# Altium schematic sheet project1 Lyalina Veronika.SchDoc
size A3; SheetNumber: 1; SheetTotal: 1
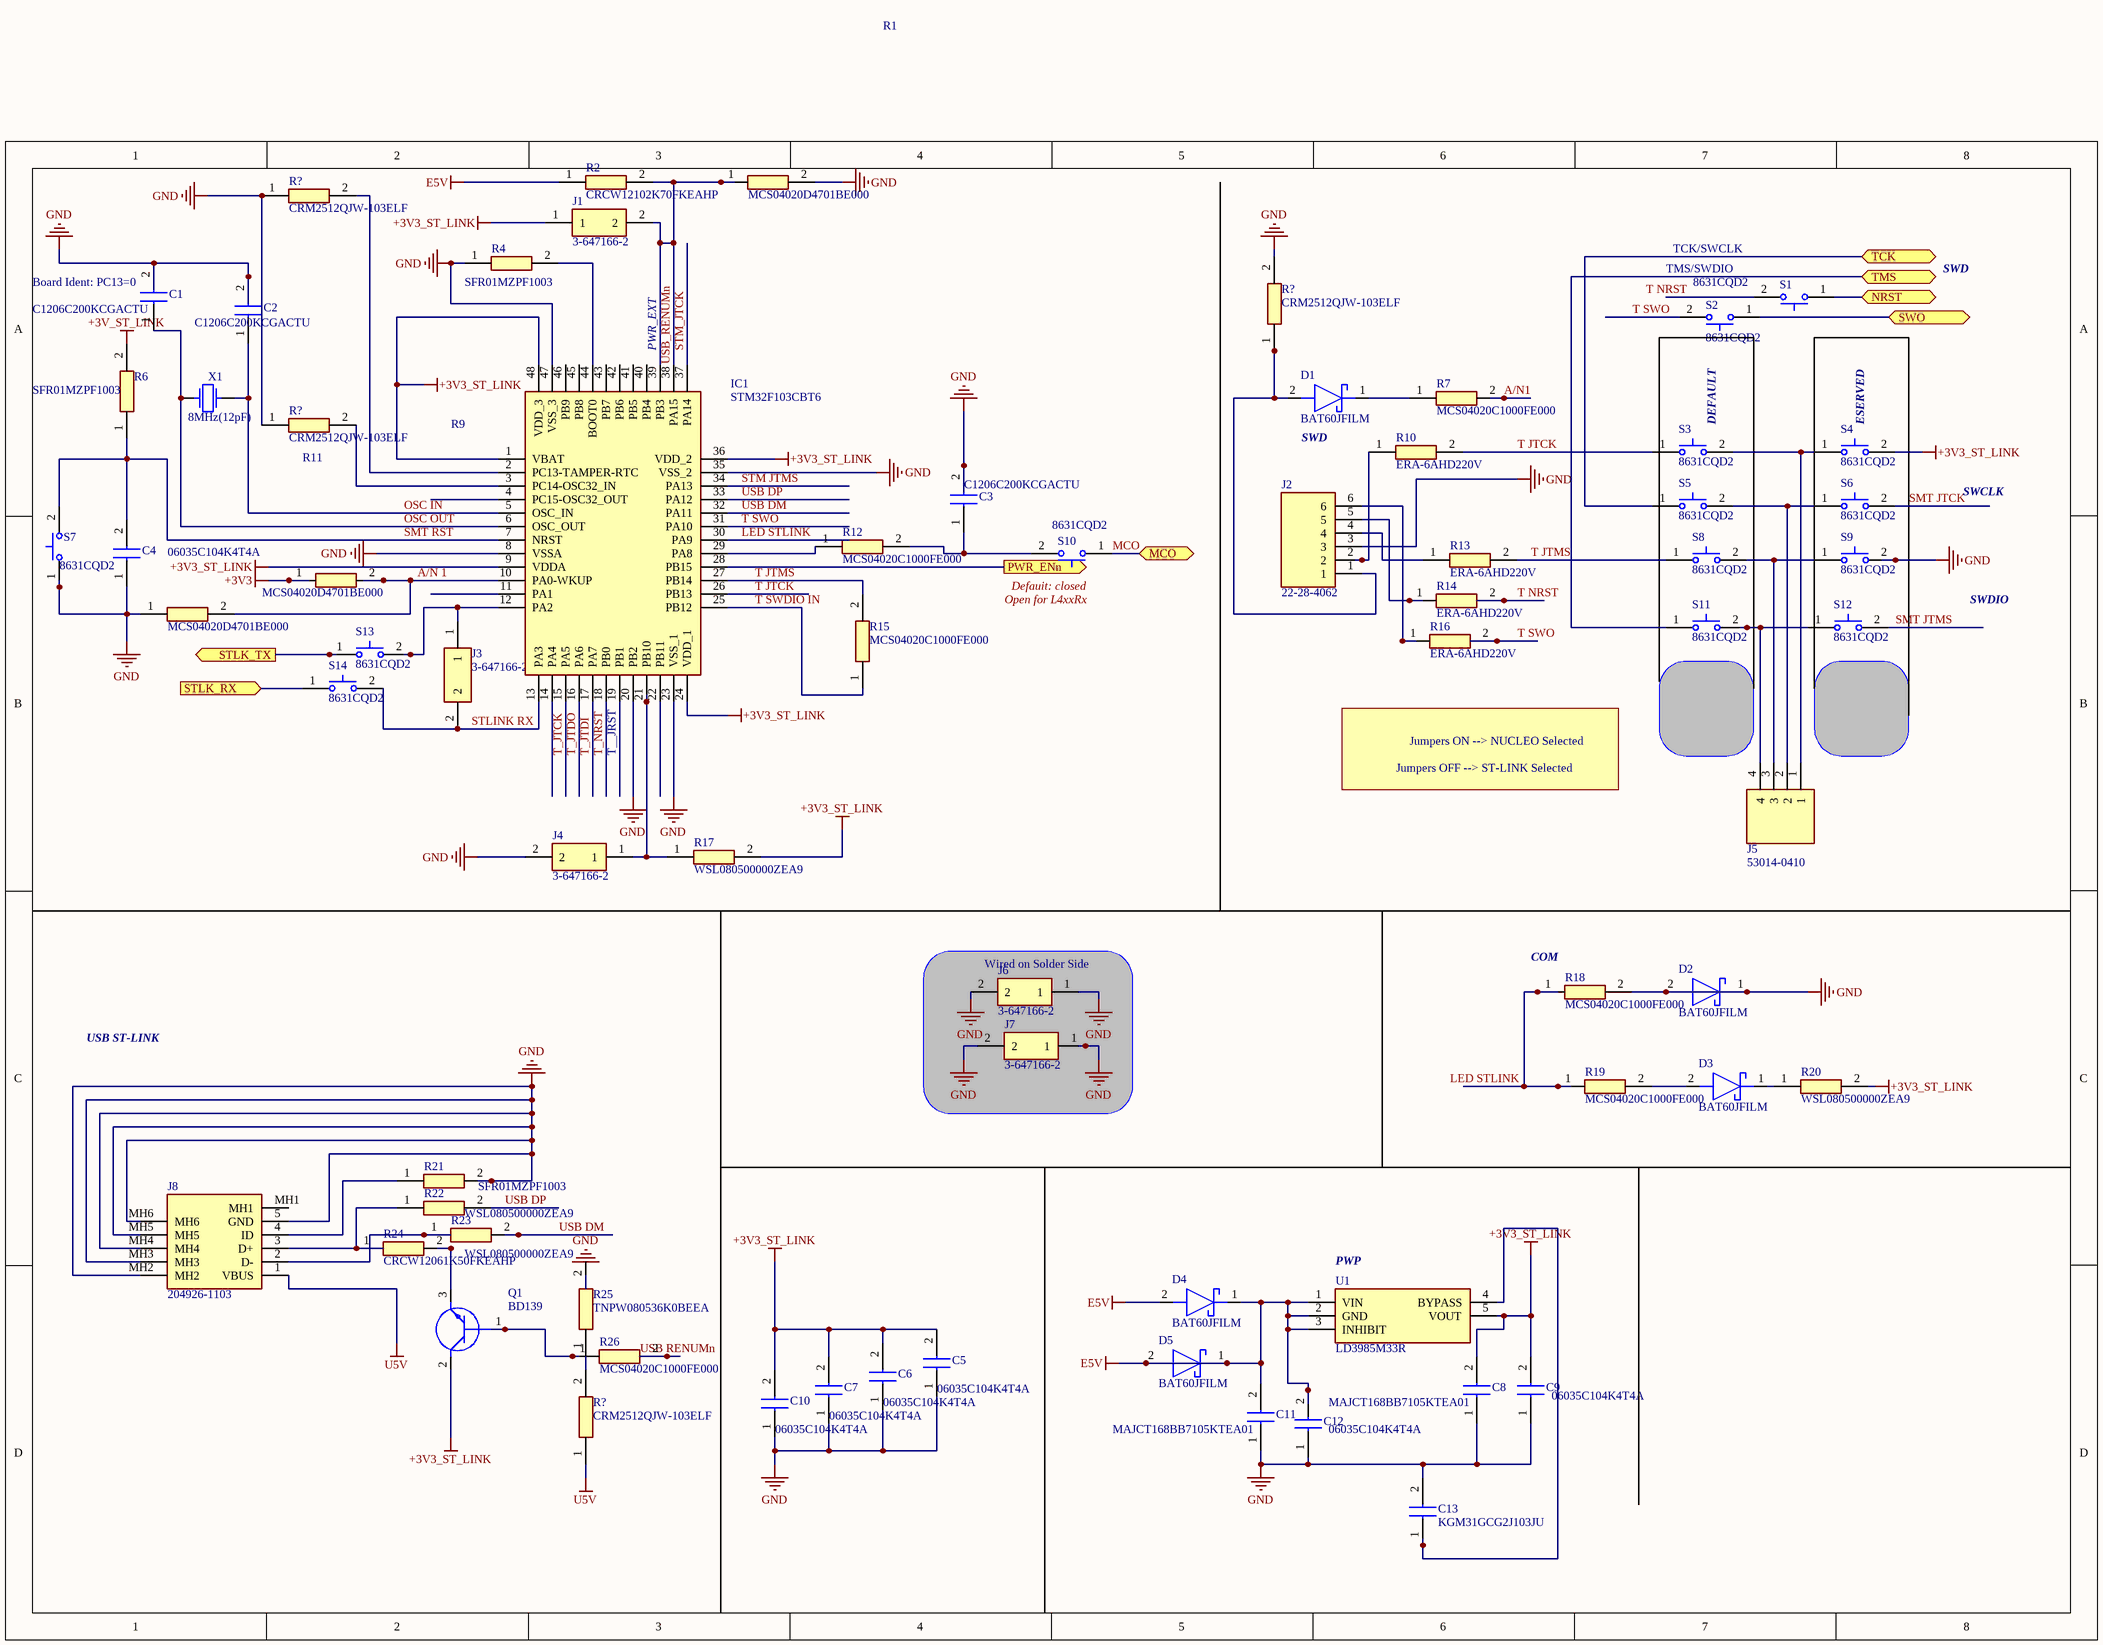
[diagram p0: project1 Lyalina Veronika.SchDoc]

## Parts
(Parts that share a designator on the sheet are numbered #1, #2 ... from top to bottom, then left to right.)
C1  C1206C200KCGACTU  [C1206]
C2  C1206C200KCGACTU  [C1206]
C3  C1206C200KCGACTU  [C1206]
C4  06035C104K4T4A  [CAPC1608X90N]
C5  06035C104K4T4A  [CAPC1608X90N]
C6  06035C104K4T4A  [CAPC1608X90N]
C7  06035C104K4T4A  [CAPC1608X90N]
C8  MAJCT168BB7105KTEA01  [MAJx16]
C9  06035C104K4T4A  [CAPC1608X90N]
C10  06035C104K4T4A  [CAPC1608X90N]
C11  MAJCT168BB7105KTEA01  [MAJx16]
C12  06035C104K4T4A  [CAPC1608X90N]
C13  KGM31GCG2J103JU  [CAPC3316X145N]
D1  BAT60JFILM  [SOD2513X117N]
D2  BAT60JFILM  [SOD2513X117N]
D3  BAT60JFILM  [SOD2513X117N]
D4  BAT60JFILM  [SOD2513X117N]
D5  BAT60JFILM  [SOD2513X117N]
IC1  STM32F103CBT6  [QFP50P900X900X160-48N]
J1  3-647166-2  [36471662]
J2  22-28-4062  [HDRV6W66P0X254_1X6_1524X249X838P]
J3  3-647166-2  [36471662]
J4  3-647166-2  [36471662]
J5  53014-0410  [SHDR4W60P0X200_1X4_1200X435X1000P]
J6  3-647166-2  [36471662]
J7  3-647166-2  [36471662]
J8  204926-1103  [2049261103]
Q1  BD139  [TO254P290X760X1320-3P]
R1  MCS04020D4701BE000  [RESC1005X37N]
R2  CRCW12102K70FKEAHP  [RESC3225X70N]
R4  SFR01MZPF1003  [RESC1005X40N]
R6  SFR01MZPF1003  [RESC1005X40N]
R7  MCS04020C1000FE000  [RESC1005X37N]
R9  MCS04020D4701BE000  [RESC1005X37N]
R10  ERA-6AHD220V  [ERA6AEB1020V]
R11  MCS04020D4701BE000  [RESC1005X37N]
R12  MCS04020C1000FE000  [RESC1005X37N]
R13  ERA-6AHD220V  [ERA6AEB1020V]
R14  ERA-6AHD220V  [ERA6AEB1020V]
R15  MCS04020C1000FE000  [RESC1005X37N]
R16  ERA-6AHD220V  [ERA6AEB1020V]
R17  WSL080500000ZEA9  [RESC2013X84N]
R18  MCS04020C1000FE000  [RESC1005X37N]
R19  MCS04020C1000FE000  [RESC1005X37N]
R20  WSL080500000ZEA9  [RESC2013X84N]
R21  SFR01MZPF1003  [RESC1005X40N]
R22  WSL080500000ZEA9  [RESC2013X84N]
R23  WSL080500000ZEA9  [RESC2013X84N]
R24  CRCW12061K50FKEAHP  [RESC3116X65N]
R25  TNPW080536K0BEEA  [RESC2012X55N]
R26  MCS04020C1000FE000  [RESC1005X37N]
R?#1  CRM2512QJW-103ELF  [RESC6331X80N]
R?#2  CRM2512QJW-103ELF  [RESC6331X80N]
R?#3  CRM2512QJW-103ELF  [RESC6331X80N]
R?#4  CRM2512QJW-103ELF  [RESC6331X80N]
S1  8631CQD2  [8631CQD2]
S2  8631CQD2  [8631CQD2]
S3  8631CQD2  [8631CQD2]
S4  8631CQD2  [8631CQD2]
S5  8631CQD2  [8631CQD2]
S6  8631CQD2  [8631CQD2]
S7  8631CQD2  [8631CQD2]
S8  8631CQD2  [8631CQD2]
S9  8631CQD2  [8631CQD2]
S10  8631CQD2  [8631CQD2]
S11  8631CQD2  [8631CQD2]
S12  8631CQD2  [8631CQD2]
S13  8631CQD2  [8631CQD2]
S14  8631CQD2  [8631CQD2]
U1  LD3985M33R  [SOT95P280X145-5N]
X1  F0: 8MHz(12pF)  (hidden comment: Crystal)

## Blocks framed on the sheet
Wired on Solder Side: J6 J7

## Ports
MCO (bidir), NRST (bidir), PWR_ENn (out), STLK_RX (in), STLK_TX (out), SWO (bidir), TCK (bidir), TMS (bidir)

## Nets
+3V3: R9.1
+3V3_ST_LINK: C5.2 C6.2 C7.2 C8.2 C9.2 C10.2 IC1.1(VBAT) IC1.9(VDDA) IC1.24(VDD_1) IC1.36(VDD_2) IC1.48(VDD_3) J1.1 Q1.2(C) R17.2 R20.2 S4.2(N.O._2) U1.5(VOUT)
+3V_ST_LINK: R6.2
E5V: C11.2 C12.2 D4.1(K) D4.2(A) D5.1(K) D5.2(A) R2.1 U1.1(VIN) U1.2(GND) U1.3(INHIBIT)
GND: C1.2 C2.2 C3.2 C4.1 C5.1 C6.1 C7.1 C8.1 C9.1 C10.1 C11.1 C12.1 C13.2 D2.1(K) D2.2(A) IC1.8(VSSA) IC1.20(PB2) IC1.23(VSS_1) IC1.35(VSS_2) IC1.47(VSS_3) J2.3 J4.2 J6.1 J6.2 J7.1 J7.2 J8.5(GND) J8.MH2 J8.MH3 J8.MH4 J8.MH5 J8.MH6 R1.2 R4.1 R11.1 R18.2 R21.2 R?#1.1 R?#2.2 R?#3.1 S7.1(N.O._1) S9.2(N.O._2)
U5V: J8.1(VBUS) R?#4.1
MCO: S10.1(N.O._1) ; port MCO
NRST: S1.1(N.O._1) ; port NRST
PWR_ENn: IC1.28(PB15) ; port PWR_ENn
STLK_RX: S14.1(N.O._1) ; port STLK_RX
STLK_TX: S13.1(N.O._1) ; port STLK_TX
SWO: S2.1(N.O._1) ; port SWO
TCK: S5.1(N.O._1) ; port TCK
TMS: S11.1(N.O._1) ; port TMS
USB DM: R23.2
USB DP: R22.2
USB RENUMn: R26.2
NetC1_1: C1.1 IC1.6(OSC_OUT) X1.1
NetC2_1: C2.1 IC1.5(OSC_IN) X1.2
NetC3_1: C3.1 R12.2 S10.2(N.O._2)
NetC4_2: C4.2 IC1.7(NRST) R6.1 S7.2(N.O._2)
NetC13_1: C13.1 U1.4(BYPASS)
NetD1_1: D1.1(K) R7.1
NetD1_2: D1.2(A) J2.1 R?#2.1
NetD3_1: D3.1(K) R20.1
NetD3_2: D3.2(A) R19.2
NetIC1_2: IC1.2(PC13-TAMPER-RTC) R?#1.2
NetIC1_3: IC1.3(PC14-OSC32_IN) R?#3.2
NetIC1_10: IC1.10(PA0-WKUP) R9.2 R11.2
NetIC1_12: IC1.12(PA2) J3.1 S13.2(N.O._2)
NetIC1_13: IC1.13(PA3) J3.2 S14.2(N.O._2)
NetIC1_21: IC1.21(PB10) J4.1 R17.1
NetIC1_25: IC1.25(PB12) R15.1
NetIC1_27: IC1.27(PB14) R15.2
NetIC1_29: IC1.29(PA8) R12.1
NetIC1_38: IC1.38(PA15) IC1.39(PB3) J1.2 R1.1 R2.2
NetIC1_44: IC1.44(BOOT0) R4.2
NetJ2_2: J2.2 R10.1
NetJ2_4: J2.4 R13.1
NetJ2_5: J2.5 R14.1
NetJ2_6: J2.6 R16.1
NetJ5_1: J5.1 S3.2(N.O._2) S4.1(N.O._1)
NetJ5_2: J5.2 S5.2(N.O._2) S6.1(N.O._1)
NetJ5_3: J5.3 S8.2(N.O._2) S9.1(N.O._1)
NetJ5_4: J5.4 S11.2(N.O._2) S12.1(N.O._1)
NetJ8_2: J8.2(D-) R23.1
NetJ8_3: J8.3(D+) R22.1 R24.1
NetJ8_4: J8.4(ID) R21.1
NetQ1_1: Q1.1(B) R26.1
NetQ1_3: Q1.3(E) R24.2
NetR10_2: R10.2 S3.1(N.O._1)
NetR13_2: R13.2 S8.1(N.O._1)
NetR18_1: R18.1 R19.1
NetR25_1: R25.1 R?#4.2

Not connected (* = marked no-connect by the designer): IC1 4(PC15-OSC32_OUT) 11(PA1) 14(PA4) 15(PA5) 16(PA6) 17(PA7) 18(PB0) 19(PB1) 22(PB11) 26(PB13) 30(PA9) 31(PA10) 32(PA11) 33(PA12) 34(PA13) 37(PA14) 40(PB4) 41(PB5) 42(PB6) 43(PB7) 45(PB8) 46(PB9); J8 MH1; R7 2; R14 2; R16 2; R25 2; S1 2(N.O._2); S2 2(N.O._2); S6 2(N.O._2); S12 2(N.O._2)

## Notes on the sheet
- (near C1) Board Ident: PC13=0
- (near S2) T SWO
- (near S2) T NRST
- TMS/SWDIO
- TCK/SWCLK
- SWD
- (near IC1) PWR_EXT
- (near IC1) USB_RENUMn
- (near IC1) STM_JTCK
- (near D1) SWD
- (near R7) A/N1
- T JTCK
- (near S3) DEFAULT
- (near S4) ESERVED
- OSC IN
- (near IC1) STM JTMS
- (near IC1) USB DP
- (near IC1) USB DM
- SMT JTCK
- SWCLK
- SMT RST
- OSC OUT
- A/N 1
- (near IC1) T SWO
- LED STLINK
- T JTMS
- (near S10) Defauit: closed
- (near S10) MCO
- (near R13) T JTMS
- T SWDIO IN
- (near S10) Open for L4xxRx
- T NRST
- T SWO
- (near S12) SMT JTMS
- SWDIO
- (near J3) STLINK RX
- (near IC1) T_JTCK
- (near IC1) T_JTDO
- (near IC1) T_JTDI
- (near IC1) T_NRST
- (near IC1) T__JRST
- Jumpers OFF --> ST-LINK Selected
- Jumpers ON --> NUCLEO Selected
- (near R18) COM
- USB ST-LINK
- (near U1) PWP

## Library data of the parts
C1-C3 = C1206C200KCGACTU: Capacitor; Manufacturer_Name: KEMET; Datasheet Link: https://content.kemet.com/datasheets/KEM_C1009_C0G_HV_SMD.pdf; Manufacturer_Part_Number: C1206C200KCGACTU
C4-C7 C9 C10 C12 = 06035C104K4T4A: Capacitor; Manufacturer_Name: Kyocera AVX; Datasheet Link: https://componentsearchengine.com/Datasheets/1/06031A100FAT2A.pdf; Height: 0.9mm; Manufacturer_Part_Number: 06035C104K4T4A; Mouser Part Number: 581-06035C104K4T4A; Mouser Price/Stock: https://www.mouser.co.uk/ProductDetail/KYOCERA-AVX/06035C104K4T4A?qs=NBj5Hwer2CEXBYKT%252BbuSBA%3D%3D; Arrow Part Number: 06035C104K4T4A; Arrow Price/Stock: https://www.arrow.com/en/products/06035c104k4t4a/avx
C8 C11 = MAJCT168BB7105KTEA01: Capacitor; Manufacturer_Name: TAIYO YUDEN; Datasheet Link: https://ds.yuden.co.jp/TYCOMPAS/or/detail?pn=MAJCT168BB7105KTEA01; Height: 0.8mm; Manufacturer_Part_Number: MAJCT168BB7105KTEA01
C13 = KGM31GCG2J103JU: Capacitor; Manufacturer_Name: Kyocera AVX; Datasheet Link: https://datasheets.kyocera-avx.com/HVKGM.pdf; Height: 1.45mm; Manufacturer_Part_Number: KGM31GCG2J103JU; Mouser Part Number: 581-KGM31GCG2J103JU; Mouser Price/Stock: https://www.mouser.co.uk/ProductDetail/KYOCERA-AVX/KGM31GCG2J103JU?qs=63Lh8XYXgjt6ivbLeGkCxg%3D%3D
D1-D5 = BAT60JFILM: Schottky Diode; Manufacturer_Name: STMicroelectronics; Datasheet Link: https://www.mouser.jp/datasheet/2/389/cd00001944-1795661.pdf; Height: 1.17mm; Manufacturer_Part_Number: BAT60JFILM; Mouser Part Number: 511-BAT60JFILM; Mouser Price/Stock: https://www.mouser.co.uk/ProductDetail/STMicroelectronics/BAT60JFILM?qs=GnFZssByvVVVnMaukcyLZg%3D%3D; Arrow Part Number: BAT60JFILM; Arrow Price/Stock: https://www.arrow.com/en/products/bat60jfilm/stmicroelectronics?region=nac
IC1 = STM32F103CBT6: Integrated Circuit; Manufacturer_Name: STMicroelectronics; Datasheet Link: http://www.st.com/st-web-ui/static/active/en/resource/technical/document/datasheet/CD00161566.pdf; Height: 1.6mm; Manufacturer_Part_Number: STM32F103CBT6; Mouser Part Number: 511-STM32F103CBT6; Mouser Price/Stock: https://www.mouser.co.uk/ProductDetail/STMicroelectronics/STM32F103CBT6?qs=WxFF5lh7QM3goh6GV5Ogig%3D%3D; Arrow Part Number: STM32F103CBT6; Arrow Price/Stock: https://www.arrow.com/en/products/stm32f103cbt6/stmicroelectronics?region=europe
J1 J3 J4 J6 J7 = 3-647166-2: Connector; Manufacturer_Name: TE Connectivity; Datasheet Link: https://www.te.com/commerce/DocumentDelivery/DDEController?Action=showdoc&DocId=Customer+Drawing%7F647166%7FR1%7Fpdf%7FEnglish%7FENG_CD_647166_R1.pdf%7F3-647166-2; Height: 10.66mm; Manufacturer_Part_Number: 3-647166-2; Mouser Part Number: 571-3-647166-2; Mouser Price/Stock: https://www.mouser.co.uk/ProductDetail/TE-Connectivity/3-647166-2?qs=xsTFCgGnzbJU1qz6Np9kzA%3D%3D; Arrow Part Number: 3-647166-2; Arrow Price/Stock: https://www.arrow.com/en/products/3-647166-2/te-connectivity?region=nac
J2 = 22-28-4062: Connector; Manufacturer_Name: Molex; Datasheet Link: https://datasheet.datasheetarchive.com/originals/distributors/SFDatasheet-1/sf-00031037.pdf; Height: 8.38mm; Manufacturer_Part_Number: 22-28-4062; Mouser Part Number: 538-22-28-4062; Mouser Price/Stock: https://www.mouser.com/Search/Refine.aspx?Keyword=538-22-28-4062
J5 = 53014-0410: Connector; Manufacturer_Name: Molex; Datasheet Link: https://www.molex.com/pdm_docs/sd/530140410_sd.pdf; Height: 10mm; Manufacturer_Part_Number: 53014-0410; Mouser Part Number: 538-53014-0410; Mouser Price/Stock: https://www.mouser.co.uk/ProductDetail/Molex/53014-0410?qs=TLs3Kb%252BkMqKk8s1WRHwRGw%3D%3D
J8 = 204926-1103: Connector; Manufacturer_Name: Molex; Datasheet Link: https://www.molex.com/content/dam/molex/molex-dot-com/products/automated/en-us/salesdrawingpdf/204/204926/2049261103_sd.pdf; Height: 4.65mm; Manufacturer_Part_Number: 204926-1103; Mouser Part Number: 538-204926-1103; Mouser Price/Stock: https://www.mouser.co.uk/ProductDetail/Molex/204926-1103?qs=55YtniHzbhBOQihiQOeiLg%3D%3D; Arrow Part Number: 204926-1103; Arrow Price/Stock: https://www.arrow.com/en/products/204926-1103/molex?region=nac
Q1 = BD139: Transistor BJT NPN; Manufacturer_Name: STMicroelectronics; Datasheet Link: http://www.st.com/web/en/resource/technical/document/datasheet/CD00001225.pdf; Height: 2.9mm; Manufacturer_Part_Number: BD139; Mouser Part Number: 511-BD139; Mouser Price/Stock: https://www.mouser.co.uk/ProductDetail/STMicroelectronics/BD139?qs=ljbEvF4DwOPW%2FLxHSWYMMA%3D%3D; Arrow Part Number: BD139; Arrow Price/Stock: https://www.arrow.com/en/products/bd139/stmicroelectronics?region=europe
R1 R9 R11 = MCS04020D4701BE000: Resistor; Manufacturer_Name: Vishay; Datasheet Link: http://www.vishay.com/docs/28705/mcx0x0xpro.pdf; Height: 0.37mm; Manufacturer_Part_Number: MCS04020D4701BE000; Mouser Part Number: 594-MCS04020D4701BE0; Mouser Price/Stock: https://www.mouser.co.uk/ProductDetail/Vishay-Beyschlag/MCS04020D4701BE000?qs=ft9OtscSA3%252BR0DpF5QqL2Q%3D%3D
R2 = CRCW12102K70FKEAHP: Resistor; Manufacturer_Name: Vishay; Datasheet Link: http://componentsearchengine.com/Datasheets/1/CRCW12102K70FKEAHP.pdf; Height: 0.7mm; Manufacturer_Part_Number: CRCW12102K70FKEAHP; Mouser Part Number: 71-CRCW12102K70FKEAH; Mouser Price/Stock: https://www.mouser.co.uk/ProductDetail/Vishay-Dale/CRCW12102K70FKEAHP?qs=OAzHGkhREL0m0%252BU1n6AaAg%3D%3D
R4 R6 R21 = SFR01MZPF1003: Resistor; Manufacturer_Name: ROHM Semiconductor; Datasheet Link: https://fscdn.rohm.com/en/products/databook/datasheet/passive/resistor/chip_resistor/sfr-e.pdf; Height: 0.4mm; Manufacturer_Part_Number: SFR01MZPF1003; Mouser Part Number: 755-SFR01MZPF1003; Mouser Price/Stock: https://www.mouser.co.uk/ProductDetail/ROHM-Semiconductor/SFR01MZPF1003?qs=Mv7BduZupUj2RFL5gMaKTg%3D%3D
R7 R12 R15 R18 R19 R26 = MCS04020C1000FE000: Resistor; Manufacturer_Name: Vishay; Datasheet Link: http://www.vishay.com/docs/28705/mcx0x0xpro.pdf; Height: 0.37mm; Manufacturer_Part_Number: MCS04020C1000FE000; Mouser Part Number: 594-MCS04020C1000FE0; Mouser Price/Stock: https://www.mouser.co.uk/ProductDetail/Vishay-Beyschlag/MCS04020C1000FE000?qs=7ZE6F4QMOBYkwvQlfbkT8w%3D%3D; Arrow Part Number: MCS04020C1000FE000; Arrow Price/Stock: https://www.arrow.com/en/products/mcs04020c1000fe000/vishay
R10 R13 R14 R16 = ERA-6AHD220V: Resistor; Manufacturer_Name: Panasonic; Datasheet Link: https://industrial.panasonic.com/cdbs/www-data/pdf/RDM0000/AOA0000C307.pdf; Height: 0.6mm; Manufacturer_Part_Number: ERA-6AHD220V; Mouser Part Number: 667-ERA-6AHD220V; Mouser Price/Stock: https://www.mouser.co.uk/ProductDetail/Panasonic/ERA-6AHD220V/?qs=MNPzkKEzRtQTWqg2JSKn2A%3D%3D
R17 R20 R22 R23 = WSL080500000ZEA9: Resistor; Manufacturer_Name: Vishay; Datasheet Link: https://ad.componentsearchengine.com/Datasheets/2/WSL080500000ZEA9.pdf; Height: 0.838mm; Manufacturer_Part_Number: WSL080500000ZEA9; Mouser Part Number: 71-WSL080500000ZEA9; Mouser Price/Stock: https://www.mouser.co.uk/ProductDetail/Vishay-Dale/WSL080500000ZEA9?qs=f1l5vAGoKgsImKS87N8TmQ%3D%3D; Arrow Part Number: WSL080500000ZEA9; Arrow Price/Stock: https://www.arrow.com/en/products/wsl080500000zea9/vishay?region=nac
R24 = CRCW12061K50FKEAHP: Resistor; Manufacturer_Name: Vishay; Datasheet Link: http://componentsearchengine.com/Datasheets/1/CRCW12061K50FKEAHP.pdf; Height: 0.65mm; Manufacturer_Part_Number: CRCW12061K50FKEAHP; Mouser Part Number: 71-CRCW12061K50FKEAH; Mouser Price/Stock: https://www.mouser.co.uk/ProductDetail/Vishay-Dale/CRCW12061K50FKEAHP?qs=k2%2FDWSARqgEwHXAQbL4aEg%3D%3D; Arrow Part Number: CRCW12061K50FKEAHP; Arrow Price/Stock: https://www.arrow.com/en/products/crcw12061k50fkeahp/vishay?region=nac
R25 = TNPW080536K0BEEA: Resistor; Manufacturer_Name: Vishay; Datasheet Link: https://www.vishay.com/docs/31006/tnpw.pdf; Height: 0.55mm; Manufacturer_Part_Number: TNPW080536K0BEEA
R?#1-R?#4 = CRM2512QJW-103ELF: Resistor; Manufacturer_Name: Bourns; Datasheet Link: http://www.bourns.com/data/global/pdfs/CRM0805_1206_2010.pdf; Height: 0.8mm; Manufacturer_Part_Number: CRM2512QJW-103ELF; Mouser Part Number: 652-CRM2512QJW-103E; Mouser Price/Stock: https://www.mouser.co.uk/ProductDetail/Bourns/CRM2512QJW-103ELF?qs=8Wlm6%252BaMh8Rzg3bRHdWGsA%3D%3D; Arrow Part Number: CRM2512QJW-103ELF; Arrow Price/Stock: https://www.arrow.com/en/products/crm2512qjw-103elf/bourns?region=nac
S1-S14 = 8631CQD2: Switch (2-Pin Push); Manufacturer_Name: C & K COMPONENTS; Datasheet Link: https://www.ckswitches.com/media/1396/8600.pdf; Height: 13.93mm; Manufacturer_Part_Number: 8631CQD2; Mouser Part Number: 611-8631-261; Mouser Price/Stock: https://www.mouser.co.uk/ProductDetail/CK/8631CQD2?qs=ktcBc77oICXe9iPhfEwnkA%3D%3D
U1 = LD3985M33R: Integrated Circuit; Manufacturer_Name: STMicroelectronics; Datasheet Link: http://www.st.com/st-web-ui/static/active/en/resource/technical/document/datasheet/CD00003395.pdf; Height: 1.45mm; Manufacturer_Part_Number: LD3985M33R; Mouser Part Number: 511-LD3985M33R; Mouser Price/Stock: https://www.mouser.co.uk/ProductDetail/STMicroelectronics/LD3985M33R?qs=22WmWNTp1rrPOccVv4HZ7A%3D%3D; Arrow Part Number: LD3985M33R; Arrow Price/Stock: https://www.arrow.com/en/products/ld3985m33r/stmicroelectronics?region=europe
X1 = Crystal: R: 500; Q: 50K; SimulationGenericComponent: True